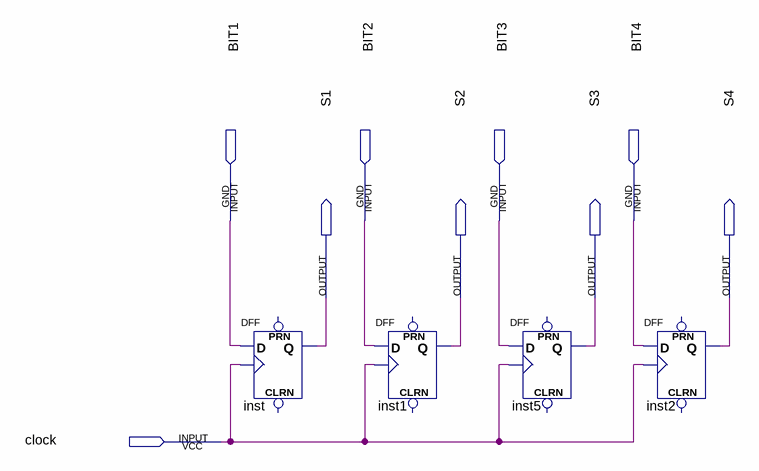
[diagram p0: schematic sheet]
// Quartus schematic registrador.bdf as structural Verilog: 4 symbols, 9 pins
module registrador (
  input  BIT1,
  input  BIT2,
  input  BIT3,
  input  BIT4,
  input  clock,
  output S1,
  output S2,
  output S3,
  output S4
);

  DFF inst (.CLK(clock), .D(BIT1), .Q(S1));  // open: CLRN, PRN
  DFF inst1 (.CLK(clock), .D(BIT2), .Q(S2));  // open: CLRN, PRN
  DFF inst5 (.CLK(clock), .D(BIT3), .Q(S3));  // open: CLRN, PRN
  DFF inst2 (.CLK(clock), .D(BIT4), .Q(S4));  // open: CLRN, PRN
endmodule
